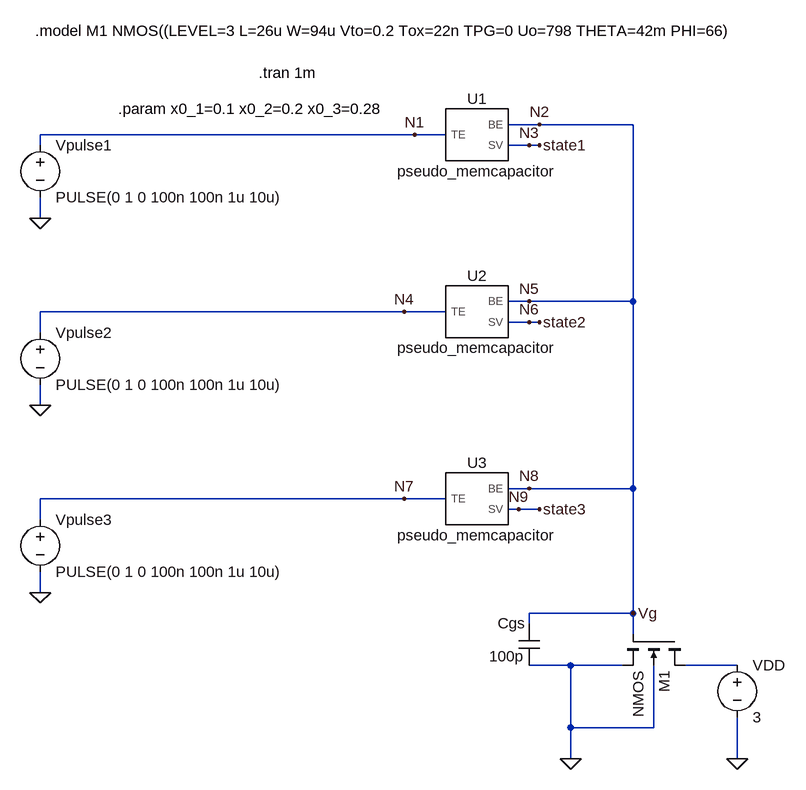
[diagram p0: schematic neuro_memristor_3x1 - xo test.asc]
neuro_memristor_3x1 - xo test.asc, the LTspice schematic file:
Version 4
SHEET 1 1936 960
WIRE 560 -176 512 -176
WIRE 704 -176 560 -176
WIRE 368 -160 -208 -160
WIRE 416 -160 368 -160
WIRE -208 -144 -208 -160
WIRE 544 -144 512 -144
WIRE 560 -144 544 -144
WIRE -208 -32 -208 -64
WIRE 544 96 512 96
WIRE 704 96 704 -176
WIRE 704 96 544 96
WIRE 352 112 -208 112
WIRE 416 112 352 112
WIRE 544 128 512 128
WIRE 560 128 544 128
WIRE -208 144 -208 112
WIRE -208 256 -208 224
WIRE 544 384 512 384
WIRE 704 384 704 96
WIRE 704 384 544 384
WIRE 352 400 -208 400
WIRE 416 400 352 400
WIRE 528 416 512 416
WIRE 560 416 528 416
WIRE -208 432 -208 400
WIRE -208 544 -208 512
WIRE 704 576 704 384
WIRE 704 576 544 576
WIRE 544 592 544 576
WIRE 704 608 704 576
WIRE 608 656 544 656
WIRE 688 656 608 656
WIRE 864 656 784 656
WIRE 608 752 608 656
WIRE 736 752 736 656
WIRE 736 752 608 752
WIRE 608 800 608 752
WIRE 864 800 864 736
FLAG -208 -32 0
FLAG 864 800 0
FLAG 608 800 0
FLAG 560 -144 state1
FLAG 704 576 Vg
FLAG 560 128 state2
FLAG 560 416 state3
FLAG -208 256 0
FLAG -208 544 0
FLAG 368 -160 N1
FLAG 560 -176 N2
FLAG 544 -144 N3
FLAG 352 112 N4
FLAG 544 96 N5
FLAG 544 128 N6
FLAG 352 400 N7
FLAG 544 384 N8
FLAG 528 416 N9
SYMBOL voltage -208 -160 R0
WINDOW 123 0 0 Left 0
WINDOW 39 0 0 Left 0
SYMATTR InstName Vpulse1
SYMATTR Value PULSE(0 1 0 100n 100n 1u 10u)
SYMBOL voltage 864 640 R0
SYMATTR InstName VDD
SYMATTR Value 3
SYMBOL nmos4 784 608 R90
SYMATTR InstName M1
SYMBOL cap 528 592 R0
WINDOW 0 -32 -1 Left 2
WINDOW 3 -45 50 Left 2
SYMATTR InstName Cgs
SYMATTR Value 100p
SYMBOL voltage -208 128 R0
SYMATTR InstName Vpulse2
SYMATTR Value PULSE(0 1 0 100n 100n 1u 10u)
SYMBOL voltage -208 416 R0
SYMATTR InstName Vpulse3
SYMATTR Value PULSE(0 1 0 100n 100n 1u 10u)
SYMBOL pseudo_memcapacitor\ X0\ TEST 464 -160 R0
SYMATTR InstName U1
SYMBOL pseudo_memcapacitor\ X0\ TEST 464 112 R0
SYMATTR InstName U2
SYMBOL pseudo_memcapacitor\ X0\ TEST 464 400 R0
SYMATTR InstName U3
TEXT 128 -256 Left 2 !.tran 1m
TEXT -216 -320 Left 2 !.model M1 NMOS((LEVEL=3 L=26u W=94u Vto=0.2 Tox=22n TPG=0 Uo=798 THETA=42m PHI=66)
TEXT -88 -200 Left 2 !.param x0_1=0.1 x0_2=0.2 x0_3=0.28

The netlist it stands for:
* neuro_memristor_3x1 - xo test.asc
Vpulse1 N1 0 PULSE(0 1 0 100n 100n 1u 10u)
VDD N001 0 3
M1 N001 N8 0 0 NMOS
Cgs N8 0 100p
Vpulse2 N4 0 PULSE(0 1 0 100n 100n 1u 10u)
Vpulse3 N7 0 PULSE(0 1 0 100n 100n 1u 10u)
XU1 N1 N8 N3 pseudo_memcapacitor  ; pins TE BE SV
XU2 N4 N8 N6 pseudo_memcapacitor  ; pins TE BE SV
XU3 N7 N8 N9 pseudo_memcapacitor  ; pins TE BE SV
.model NMOS NMOS
.model PMOS PMOS
.lib standard.mos
.tran 1m
.model M1 NMOS((LEVEL=3 L=26u W=94u Vto=0.2 Tox=22n TPG=0 Uo=798 THETA=42m PHI=66)
.param x0_1=0.1 x0_2=0.2 x0_3=0.28
.lib C:\Users\dhanu\OneDrive\Documents\My files\GITHUB\Neuro-transistor-Simulation-with-Memristor-based-Memcapacitor-using-LTSPICE\src\X0 TEST\pseudo_memcapacitor x0 test.cir
.backanno
.end